# Altium project LED Project.PrjPcb
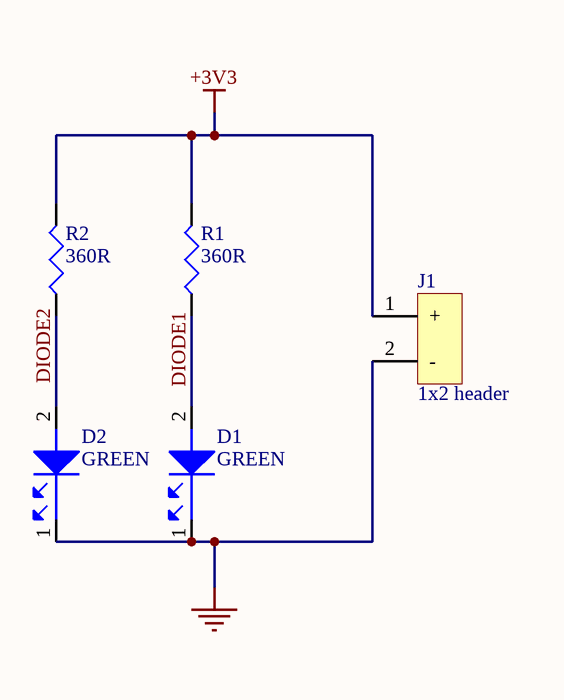
[diagram p0: LED.SchDoc]
1 sheet, 5 parts. Net scope: global (net labels, ports and power ports of the same name join across sheets).
Board file: LED.PcbDoc

## Sheet LED.SchDoc
size A; SheetNumber: 1; SheetTotal: 1

### Parts
D1  GREEN  [LED0603G]
D2  GREEN  [LED0603G]
J1  1x2 header  [HDR1X2]
R1  360R  [R0805]
R2  360R  [R0805]

### Nets
+3V3: J1.1(+) R1.2 R2.2
GND: D1.1 D2.1 J1.2(-)
DIODE1: D1.2 R1.1
DIODE2: D2.2 R2.1

### Library data of the parts
D1 D2 = SML-512MWT86: Single Color LED, Yellow Green, Milky White, 1.2mm; Manufacturer: Rohm; Color: Green,Yellow; Shape: Rectangular; Forward Current: 25mA; Luminous Intensity-Nom: 40mcd; Channels: 1; Overall Height: 0.55mm; Category_led: Optoelectronics; Supplier: Future Electronics; Supplier Part Number: 6023738; Manufacturer Part Number: SML-512MWT86; RoHS: Yes; Category: LEDs; Stock: 9000; Pricing: 3000=0.0587, 6000=0.0572, 12000=0.0558, 15000=0.0553, 45000=0.0525 (USD); Mounting Technology: Surface Mount; Pins: 2; Terminal Finish: Nickel; Min Operating Temperature: -30°C; Max Operating Temperature: 85°C; JESD-609 Code: e4; Lens Style: MILKY WHITE; Optoelectronic Device Type: SINGLE COLOR LED; Packaging: Tape and Reel; Size: 1.2mm; Terminal Pitch: 1.65mm; Reach SVHC Compliant: Yes; RoHS Compliant: Yes; ComponentLink1URL: https://datasheet.ciiva.com:443/pdfs/VipMasterIC/IC/ROHM/ROHMS10480/ROHMS10480-1.pdf?src-supplier=IHS+Markit; ComponentLink1Description: https://datasheet.ciiva.com:443/pdfs/VipMasterIC/IC/ROHM/ROHMS10480/ROHMS10480-1.pdf?src-supplier=IHS+Markit; ComponentLink2URL: https://datasheet.ciiva.com/16199/sml-512mwt86-16199690.pdf?src-supplier=Future+Electronics; ComponentLink2Description: https://datasheet.ciiva.com/16199/sml-512mwt86-16199690.pdf?src-supplier=Future+Electronics; ComponentLink3URL: https://datasheet.ciiva.com/11774/0900766b80df3a76-11774071.pdf?src-supplier=Rs; ComponentLink3Description: https://datasheet.ciiva.com/11774/0900766b80df3a76-11774071.pdf?src-supplier=Rs; ComponentLink4URL: https://datasheet.ciiva.com/3161/sml-51-3161414.pdf?src-supplier=Avnet; ComponentLink4Description: https://datasheet.ciiva.com/3161/sml-51-3161414.pdf?src-supplier=Avnet; ComponentLink5URL: https://datasheet.ciiva.com/2110/sml-51-2110724.pdf?src-supplier=Digikey; ComponentLink5Description: https://datasheet.ciiva.com/2110/sml-51-2110724.pdf?src-supplier=Digikey; ComponentLink6URL: https://datasheet.ciiva.com/2110/sml-51-2110725.pdf?src-supplier=Digikey; ComponentLink6Description: https://datasheet.ciiva.com/2110/sml-51-2110725.pdf?src-supplier=Digikey; ComponentLink7URL: https://datasheet.ciiva.com/2110/sml-51-2110726.pdf?src-supplier=Digikey; ComponentLink7Description: https://datasheet.ciiva.com/2110/sml-51-2110726.pdf?src-supplier=Digikey
J1 = 22-29-2021: Board Connector, 2 Contact(s), 1 Row(s), Male, Straight, 0.1 inch Pitch, Solder Terminal, Locking, White Insulator, Receptacle; Manufacturer: Molex; Option: General Purpose; Contact Pattern: RECTANGULAR; Contact Resistance: 10mR; Contact Style: SQ PIN-SKT; Durability: 25Cycles; Filter Feature: No; Insulation Resistance: 1GR; Mating Information: MULTIPLE MATING PARTS AVAILABLE; Number Of Connectors: 1; Polarization Key: POLARIZED HOUSING; Rated Current (Signal): 4A; Number of Contacts: 2; Body Breadth: 0.23inch; Body Depth: 0.46inch; Body Length: 0.2inch; Plating Thickness: 20uin; Reference Standard: UL; Reliability: COMMERCIAL; Supplier: Avnet; RoHS: Yes; Category: Headers and Wire Housings; Stock: 29747; Pricing: 1=0.16226 (USD); Mounting Technology: Board; Contact Finish - Mating: GOLD; Contact Finish - Termination: Gold (Au); Insulation Color: White; Insulation Material: Nylon; Min Operating Temperature: 0°C; Max Operating Temperature: 75°C; Connector Type: BOARD CONNECTOR; JESD-609 Code: e4; Body/Shell Style: RECEPTACLE; Contact Gender: Male; Mixed Contacts: No; Mounting Style: STRAIGHT; Number Of PCB Rows: 1; Number of Rows Loaded: 1; PCB Contact Pattern: RECTANGULAR; Termination: Solder; Mating Contact Pitch: 0.1inch; Mounting Option 1: LOCKING; Terminal Length: 0.14inch; Terminal Pitch: 2.54mm; Flammability Rating: UL94 V-0; Reach SVHC Compliant: Yes; RoHS Compliant: Yes; DIN Conformance: No; IEC Conformance: No; MIL Conformance: No; ComponentLink1URL: https://datasheet.ciiva.com:443/pdfs/VipMasterIC/IC/MOLE/MOLE-E-A0003552261/MOLE-S-A0003534498-1.pdf?src-supplier=IHS+Markit; ComponentLink1Description: https://datasheet.ciiva.com:443/pdfs/VipMasterIC/IC/MOLE/MOLE-E-A0003552261/MOLE-S-A0003534498-1.pdf?src-supplier=IHS+Markit; Manufacturer Part Number: 22-29-2021; Supplier Part Number: 0022292021; Category_LED: Connector
R1 R2 = CRCW0805360RFKEA: Fixed Resistor, Metal Glaze/thick Film, 0.125W, 360ohm, 150V, 1% +/-Tol, 100ppm/Cel, Surface Mount, 0805; Manufacturer: Vishay; Power: 125mW; Rated Temperature: 70°C; Temperature Coefficient: 100ppm/°C; Package Height: 0.45mm; Package Length: 2mm; Package Width: 1.25mm; Reference Standard: AEC-Q200; Catagory: Resistors; Supplier: Avnet; Supplier Part Number: 42K4495; Manufacturer Part Number: CRCW0805360RFKEA; RoHS: Yes; Category: Chip SMD Resistors; Stock: 30000; Pricing: 5000=0.008, 10000=0.007 (USD); Mounting Technology: Surface Mount; Pins: 2; Package Shape: Rectangular; Case/Package: 0805; Terminal Finish: Nickel; Min Operating Temperature: -55°C; Max Operating Temperature: 155°C; Tolerance: 1%; JESD-609 Code: e3; Resistor Type: FIXED RESISTOR; Construction: Chip; Package Style: SMTMeter; Packaging: Tape and Reel; Value: 360R; Technology: METAL GLAZE/THICK FILM; Termination: Wraparound; Working Voltage: 150V; RoHS Compliant: Yes; Reach SVHC Compliant: Yes; ComponentLink1URL: https://datasheet.ciiva.com:443/pdfs/VipMasterIC/IC/VISH/VISH-S-A0007266705/VISH-S-A0007266705-1.pdf?src-supplier=IHS+Markit; ComponentLink1Description: https://datasheet.ciiva.com:443/pdfs/VipMasterIC/IC/VISH/VISH-S-A0007266705/VISH-S-A0007266705-1.pdf?src-supplier=IHS+Markit; ComponentLink2URL: https://datasheet.ciiva.com/2467/dcrcwe3-2467773.pdf?src-supplier=Digikey; ComponentLink2Description: https://datasheet.ciiva.com/2467/dcrcwe3-2467773.pdf?src-supplier=Digikey

## Assembly variants
LED2 Not Fitted: not fitted D2 R2